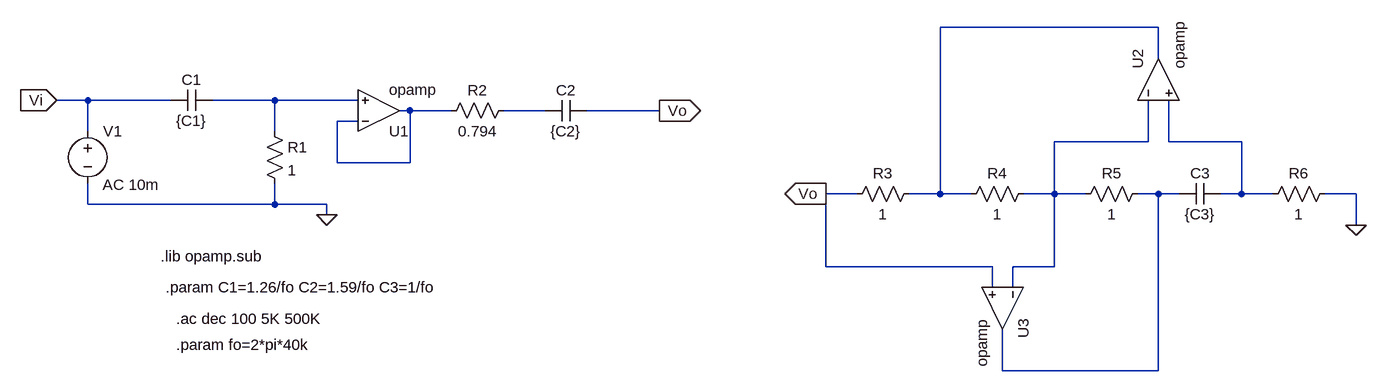
[diagram p0: schematic Ts4_Activo.asc]
Ts4_Activo.asc, the LTspice schematic file:
Version 4
SHEET 1 1844 680
WIRE 1520 0 1184 0
WIRE 1520 48 1520 0
WIRE -128 112 -176 112
WIRE 0 112 -128 112
WIRE 160 112 64 112
WIRE 288 112 160 112
WIRE 368 128 352 128
WIRE 432 128 368 128
WIRE 576 128 512 128
WIRE 752 128 640 128
WIRE 288 144 256 144
WIRE -128 160 -128 112
WIRE 160 160 160 112
WIRE 1504 176 1504 112
WIRE 1504 176 1360 176
WIRE 1536 176 1536 112
WIRE 1648 176 1536 176
WIRE 256 208 256 144
WIRE 368 208 368 128
WIRE 368 208 256 208
WIRE 1056 256 1008 256
WIRE 1184 256 1184 0
WIRE 1184 256 1136 256
WIRE 1232 256 1184 256
WIRE 1360 256 1360 176
WIRE 1360 256 1312 256
WIRE 1408 256 1360 256
WIRE 1520 256 1488 256
WIRE 1552 256 1520 256
WIRE 1648 256 1648 176
WIRE 1648 256 1616 256
WIRE 1696 256 1648 256
WIRE 1824 256 1776 256
WIRE -128 272 -128 240
WIRE 160 272 160 240
WIRE 160 272 -128 272
WIRE 240 272 160 272
WIRE 240 288 240 272
WIRE 1824 304 1824 256
WIRE 1008 368 1008 256
WIRE 1264 368 1008 368
WIRE 1360 368 1360 256
WIRE 1360 368 1296 368
WIRE 1264 400 1264 368
WIRE 1296 400 1296 368
WIRE 1280 528 1280 464
WIRE 1520 528 1520 256
WIRE 1520 528 1280 528
FLAG 240 288 0
FLAG 752 128 Vo
IOPIN 752 128 Out
FLAG -176 112 Vi
IOPIN -176 112 In
FLAG 1824 304 0
FLAG 1008 256 Vo
IOPIN 1008 256 Out
SYMBOL cap 64 96 R90
WINDOW 0 0 32 VBottom 2
WINDOW 3 32 32 VTop 2
SYMATTR InstName C1
SYMATTR Value {C1}
SYMBOL res 144 144 R0
SYMATTR InstName R1
SYMATTR Value 1
SYMBOL res 528 112 R90
WINDOW 0 0 56 VBottom 2
WINDOW 3 32 56 VTop 2
SYMATTR InstName R2
SYMATTR Value 0.794
SYMBOL cap 640 112 R90
WINDOW 0 0 32 VBottom 2
WINDOW 3 32 32 VTop 2
SYMATTR InstName C2
SYMATTR Value {C2}
SYMBOL OpAmps\\opamp 320 192 M180
SYMATTR InstName U1
SYMBOL voltage -128 144 R0
WINDOW 123 23 98 Left 2
WINDOW 39 0 0 Left 0
SYMATTR Value2 AC 10m
SYMATTR InstName V1
SYMATTR Value ""
SYMBOL res 1152 240 R90
WINDOW 0 0 56 VBottom 2
WINDOW 3 32 56 VTop 2
SYMATTR InstName R3
SYMATTR Value 1
SYMBOL res 1328 240 R90
WINDOW 0 0 56 VBottom 2
WINDOW 3 32 56 VTop 2
SYMATTR InstName R4
SYMATTR Value 1
SYMBOL res 1504 240 R90
WINDOW 0 0 56 VBottom 2
WINDOW 3 32 56 VTop 2
SYMATTR InstName R5
SYMATTR Value 1
SYMBOL res 1792 240 R90
WINDOW 0 0 56 VBottom 2
WINDOW 3 32 56 VTop 2
SYMATTR InstName R6
SYMATTR Value 1
SYMBOL cap 1616 240 R90
WINDOW 0 0 32 VBottom 2
WINDOW 3 32 32 VTop 2
SYMATTR InstName C3
SYMATTR Value {C3}
SYMBOL OpAmps\\opamp 1456 80 R270
SYMATTR InstName U2
SYMBOL OpAmps\\opamp 1344 432 R90
SYMATTR InstName U3
TEXT -16 352 Left 2 !.lib opamp.sub
TEXT -8 400 Left 2 !.param C1=1.26/fo C2=1.59/fo C3=1/fo
TEXT 8 448 Left 2 !.ac dec 100 5K 500K
TEXT 8 488 Left 2 !.param fo=2*pi*40k

The netlist it stands for:
* Ts4_Activo.asc
C1 N002 Vi {C1}
R1 N002 0 1
R2 N004 N003 0.794
C2 Vo N004 {C2}
XU1 N003 N002 N003 opamp Aol=100K GBW=10Meg  ; pins invin noninvin out
V1 Vi 0 AC 10m
R3 N001 Vo 1
R4 N005 N001 1
R5 N007 N005 1
R6 0 N006 1
C3 N006 N007 {C3}
XU2 N005 N006 N001 opamp Aol=100K GBW=10Meg  ; pins invin noninvin out
XU3 N005 Vo N007 opamp Aol=100K GBW=10Meg  ; pins invin noninvin out
.lib opamp.sub
.param C1=1.26/fo C2=1.59/fo C3=1/fo
.ac dec 100 5K 500K
.param fo=2*pi*40k
.backanno
.end